# Altium schematic sheet USB_Hub_AMCbox.SchDoc: USB
size 420 x 297 mm; Author: G.Kasprowicz; CompanyName: WUT ISE; DrawnBy: G.Kasprowicz; Organization: WUT ISE; Address1: PW ISE; Address2: Nowowiejska 15/19 00-665 Warsaw; Address3: gkasprow@gmail.com; DocumentNumber: 13; Revision: 2; SheetNumber: 13; SheetTotal: 18; ModifiedBy: -; CheckedDate: -; Title2: Hub; DivGrp: WUT ISE; Designer: G.Kasprowicz; ModifiedDate: -; ProjectName: Sensor Box
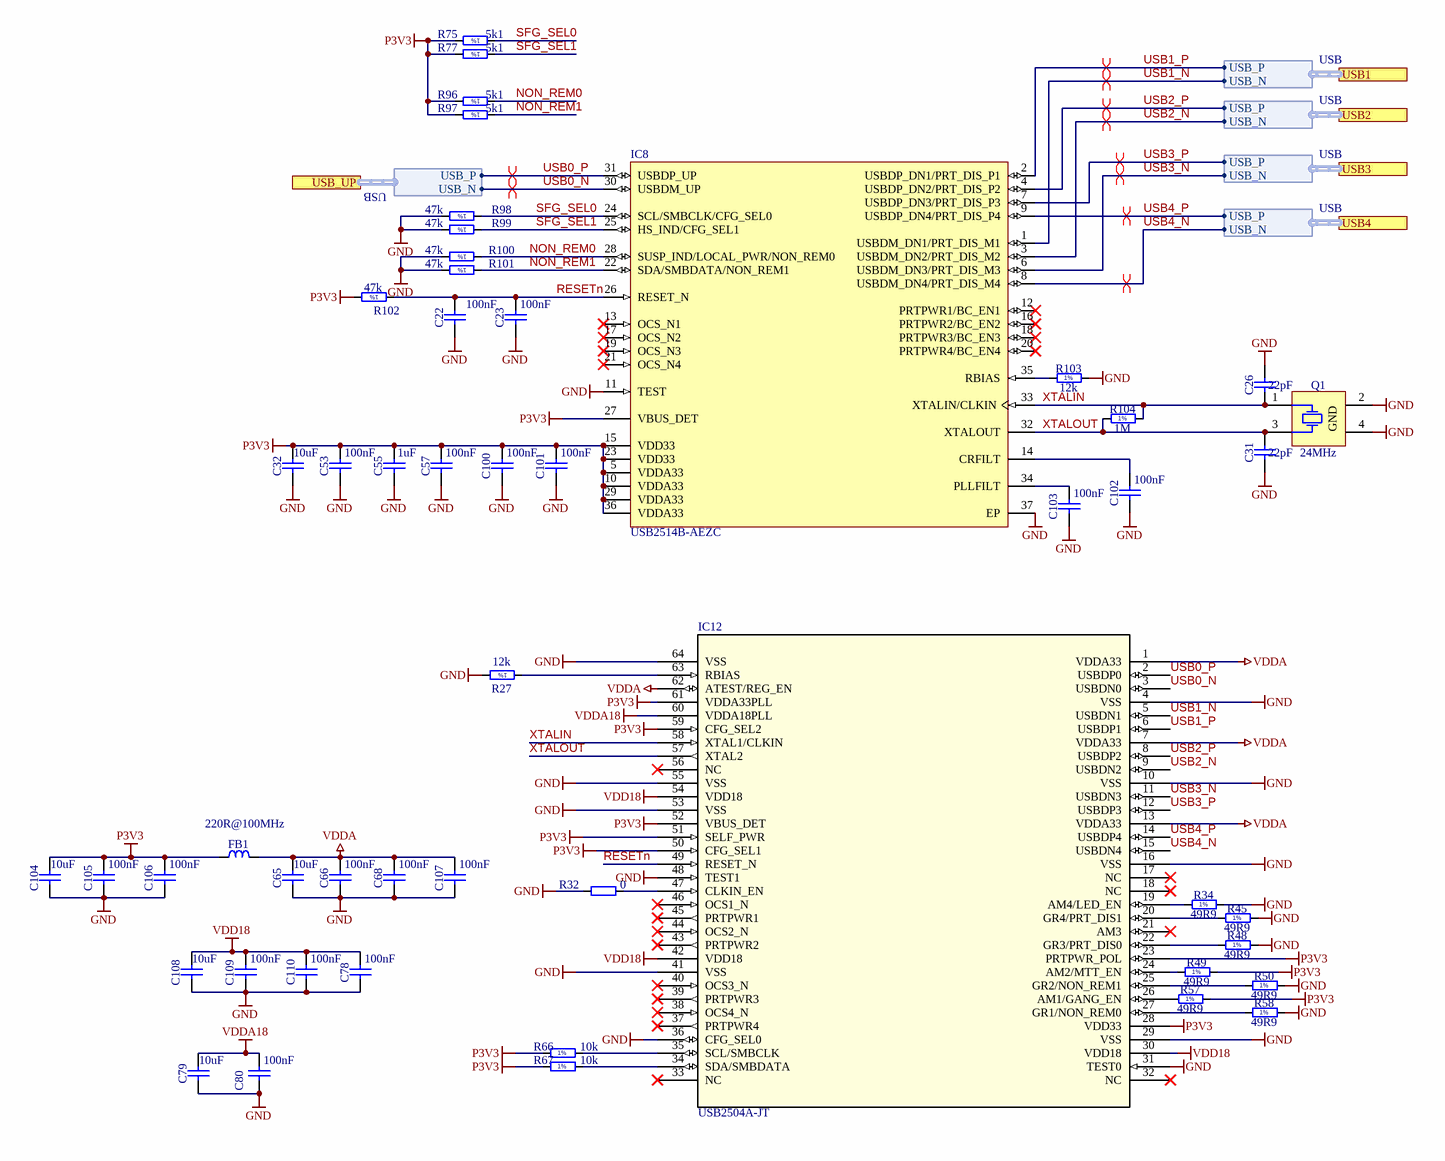
[diagram p0: USB_Hub_AMCbox.SchDoc]

## Parts
C22  100nF  [CAPC0603X33N]
C23  100nF  [CAPC0603X33N]
C26  22pF  [CAPC1005X55N]
C31  22pF  [CAPC1005X55N]
C32  10uF  [CAPC1608X80N]
C53  100nF  [CAPC0603X33N]
C55  1uF  [CAPC1005X55N]
C57  100nF  [CAPC0603X33N]
C65  10uF  [CAPC1608X80N]
C66  100nF  [CAPC0603X33N]
C68  100nF  [CAPC0603X33N]
C78  100nF  [CAPC0603X33N]
C79  10uF  [CAPC1608X80N]
C80  100nF  [CAPC0603X33N]
C100  100nF  [CAPC0603X33N]
C101  100nF  [CAPC0603X33N]
C102  100nF  [CAPC0603X33N]
C103  100nF  [CAPC0603X33N]
C104  10uF  [CAPC1608X80N]
C105  100nF  [CAPC0603X33N]
C106  100nF  [CAPC0603X33N]
C107  100nF  [CAPC0603X33N]
C108  10uF  [CAPC1608X80N]
C109  100nF  [CAPC0603X33N]
C110  100nF  [CAPC0603X33N]
FB1  220R@100MHz  [INDC2012X105N]
IC8  USB2514B-AEZC  [MCHP-QFN-36_V]
IC12  USB2504A-JT  [TQFP64_10x10MC_MCH]
Q1  24MHz  [XTAL_PERICOM_FL]
R27  12k  [RESC1005X40N]
R32  0  [RESC1005X40N]
R34  49R9  [RESC1005X40N]
R45  49R9  [RESC1005X40N]
R48  49R9  [RESC1005X40N]
R49  49R9  [RESC1005X40N]
R50  49R9  [RESC1005X40N]
R57  49R9  [RESC1005X40N]
R58  49R9  [RESC1005X40N]
R66  10k  [RESC1005X40N]
R67  10k  [RESC1005X40N]
R75  5k1  [RESC1005X40N]
R77  5k1  [RESC1005X40N]
R96  5k1  [RESC1005X40N]
R97  5k1  [RESC1005X40N]
R98  47k  [RESC1005X40N]
R99  47k  [RESC1005X40N]
R100  47k  [RESC1005X40N]
R101  47k  [RESC1005X40N]
R102  47k  [RESC1005X40N]
R103  12k  [RESC1005X40N]
R104  1M  [RESC1005X40N]

## Ports
USB1 (harness USB), USB2 (harness USB), USB3 (harness USB), USB4 (harness USB), USB_UP (harness USB)

## Harnesses
USB: USB_N, USB_P

## Nets
GND: C22.1 C23.1 C26.2 C31.1 C32.1 C53.1 C55.1 C57.1 C65.1 C66.1 C68.1 C78.1 C79.1 C80.1 C100.1 C101.1 C102.1 C103.1 C104.1 C105.1 C106.1 C107.1 C108.1 C109.1 C110.1 IC8.11(TEST) IC8.37(EP) IC12.4(VSS) IC12.10(VSS) IC12.16(VSS) IC12.29(VSS) IC12.31(TEST0) IC12.36(CFG_SEL0) IC12.41(VSS) IC12.48(TEST1) IC12.53(VSS) IC12.55(VSS) IC12.64(VSS) Q1.2(GND) Q1.4(GND) R27.2 R32.1 R34.2 R45.2 R48.2 R50.2 R58.2 R98.2 R99.2 R100.2 R101.2 R103.2
P3V3: C32.2 C53.2 C55.2 C57.2 C100.2 C101.2 C104.2 C105.2 C106.2 FB1.1 IC8.5(VDDA33) IC8.10(VDDA33) IC8.15(VDD33) IC8.23(VDD33) IC8.27(VBUS_DET) IC8.29(VDDA33) IC8.36(VDDA33) IC12.23(PRTPWR_POL) IC12.28(VDD33) IC12.50(CFG_SEL1) IC12.51(SELF_PWR) IC12.52(VBUS_DET) IC12.59(CFG_SEL2) IC12.61(VDDA33PLL) R49.2 R57.2 R66.1 R67.1 R75.2 R77.2 R96.2 R97.2 R102.2
VDD18: C78.2 C108.2 C109.2 C110.2 IC12.30(VDD18) IC12.42(VDD18) IC12.54(VDD18)
VDDA: C65.2 C66.2 C68.2 C107.2 FB1.2 IC12.1(VDDA33) IC12.7(VDDA33) IC12.13(VDDA33) IC12.62(ATEST/REG_EN)
VDDA18: C79.2 C80.2 IC12.60(VDDA18PLL)
NON_REM0: IC8.28(SUSP_IND/LOCAL_PWR/NON_REM0) R96.1 R100.1
NON_REM1: IC8.22(SDA/SMBDATA/NON_REM1) R97.1 R101.1
RESETn: C22.2 C23.2 IC8.26(RESET_N) IC12.49(RESET_N) R102.1
SFG_SEL0: IC8.24(SCL/SMBCLK/CFG_SEL0) R75.1 R98.1
SFG_SEL1: IC8.25(HS_IND/CFG_SEL1) R77.1 R99.1
USB0_N: IC8.30(USBDM_UP) IC12.3(USBDN0) ; port USB_UP.USB_N
USB0_P: IC8.31(USBDP_UP) IC12.2(USBDP0) ; port USB_UP.USB_P
USB1_N: IC8.1(USBDM_DN1/PRT_DIS_M1) IC12.5(USBDN1) ; port USB1.USB_N
USB1_P: IC8.2(USBDP_DN1/PRT_DIS_P1) IC12.6(USBDP1) ; port USB1.USB_P
USB2_N: IC8.3(USBDM_DN2/PRT_DIS_M2) IC12.9(USBDN2) ; port USB2.USB_N
USB2_P: IC8.4(USBDP_DN2/PRT_DIS_P2) IC12.8(USBDP2) ; port USB2.USB_P
USB3_N: IC8.6(USBDM_DN3/PRT_DIS_M3) IC12.11(USBDN3) ; port USB3.USB_N
USB3_P: IC8.7(USBDP_DN3/PRT_DIS_P3) IC12.12(USBDP3) ; port USB3.USB_P
USB4_N: IC8.8(USBDM_DN4/PRT_DIS_M4) IC12.15(USBDN4) ; port USB4.USB_N
USB4_P: IC8.9(USBDP_DN4/PRT_DIS_P4) IC12.14(USBDP4) ; port USB4.USB_P
XTALIN: C26.1 IC8.33(XTALIN/CLKIN) IC12.58(XTAL1/CLKIN) Q1.1(X) R104.2
XTALOUT: C31.2 IC8.32(XTALOUT) IC12.57(XTAL2) Q1.3(X) R104.1
NetC102_2: C102.2 IC8.14(CRFILT)
NetC103_2: C103.2 IC8.34(PLLFILT)
NetIC8_35: IC8.35(RBIAS) R103.1
NetIC12_19: IC12.19(AM4/LED_EN) R34.1
NetIC12_20: IC12.20(GR4/PRT_DIS1) R45.1
NetIC12_22: IC12.22(GR3/PRT_DIS0) R48.1
NetIC12_24: IC12.24(AM2/MTT_EN) R49.1
NetIC12_25: IC12.25(GR2/NON_REM1) R50.1
NetIC12_26: IC12.26(AM1/GANG_EN) R57.1
NetIC12_27: IC12.27(GR1/NON_REM0) R58.1
NetIC12_34: IC12.34(SDA/SMBDATA) R67.2
NetIC12_35: IC12.35(SCL/SMBCLK) R66.2
NetIC12_47: IC12.47(CLKIN_EN) R32.2
NetIC12_63: IC12.63(RBIAS) R27.1

Not connected (* = marked no-connect by the designer): IC8 12(PRTPWR1/BC_EN1)* 13(OCS_N1)* 16(PRTPWR2/BC_EN2)* 17(OCS_N2)* 18(PRTPWR3/BC_EN3)* 19(OCS_N3)* 20(PRTPWR4/BC_EN4)* 21(OCS_N4)*; IC12 17(NC)* 18(NC)* 21(AM3)* 32(NC)* 33(NC)* 37(PRTPWR4)* 38(OCS4_N)* 39(PRTPWR3)* 40(OCS3_N)* 43(PRTPWR2)* 44(OCS2_N)* 45(PRTPWR1)* 46(OCS1_N)* 56(NC)*

## Layout directives
differential pair: USB0_N, USB0_P, USB1_N, USB1_P, USB2_N, USB2_P, USB3_N, USB3_P, USB4_N, USB4_P

## Notes on the sheet
- Project/Equipment
- Document
- Designer
- Drawn by
- Check.by
- Copyright WUT ISE 2020.
  This documentation describes Open Hardware and is licensed under the CERN OHL v.1.2. You may redistribute and modify this documentation under the terms of the CERN OHL v.1.2. (http://ohwr.org/CERNOHL). This documentation is distributed WITHOUT ANY EXPRESS OR IMPLIED WARRANTY, INCLUDING OF MERCHANTABILITY, SATISFACTORY QUALITY AND FITNESS FOR A PARTICULAR PURPOSE. Please see the CERN OHL v.1.2 for applicable conditions.
- Contact
- File
- Last Mod.
- Print Date
- Sheet
- Size
- A3
- of
- Rev
- (in symbol R0402_1M_1%_0.0625W_100PPM) 1%
- (in symbol R0402_5K1_1%_0.0625W_100PPM) 1%
- (in symbol R0402_10K_1%_0.0625W_100PPM) 1%
- (in symbol R0402_12K_1%_0.0625W_100PPM) 1%
- (in symbol R0402_47K_1%_0.0625W_100PPM) 1%
- (in symbol R0402_49R9_1%_0.0625W_100PPM) 1%

## Library data of the parts
C22 C23 C53 C57 C66 C68 C78 C80 C100-C103 C105-C107 C109 C110 = CC0201_100NF_6.3V_10%_X5R: Non-polarised capacitor; Part Description: SMD Multilayer Chip Ceramic Capacitor; Manufacturer: GENERIC; Manufacturer1 Part Number: 02016D104KAT2A; Voltage: 6.3V; TC: X5R; Tolerance: ±10%; Part Number: CC0201_100NF_6.3V_10%_X5R; Component Kind: Standard; Component Type: Standard; Pin Count: 2; Value: 100nF; Status: Not Recommended; Manufacturer Part Number: CC0201_100NF_6.3V_10%_X5R; Case: 0201; Mounted: Yes; Socket: No; SMD: Yes; Sense: No; Manufacturer1 Example: AVX; Manufacturer1 ComponentHeight: 0.33mm; HelpURL: \\cern.ch\dfs\Applications\Altium\Datasheets\CC0201_X5R_AVX.pdf; Author: CERN DEM JLC; CreateDate: 03/12/2007; LatestRevisionDate: 03/12/2007
C26 C31 = CC0402_22PF_50V_5%_C0G: Non-polarised capacitor; Part Description: SMD Multilayer Chip Ceramic Capacitor; Manufacturer: GENERIC; Manufacturer1 Part Number: C0402C220J5GACTU; Voltage: 50V; TC: C0G/NP0; Tolerance: ±5%; Part Number: CC0402_22PF_50V_5%_C0G; Component Kind: Standard; Component Type: Standard; Pin Count: 2; Value: 22pF; Status: Preferred; Manufacturer Part Number: CC0402_22PF_50V_5%_C0G; Case: 0402; Mounted: Yes; Socket: No; SMD: Yes; Sense: No; Manufacturer1 Example: KEMET; Manufacturer1 ComponentHeight: 0.55mm; HelpURL: \\cern.ch\dfs\Applications\Altium\Datasheets\CC0402_C0G_KEMET_(Commercial Grade).pdf; Author: CERN DEM JLC; CreateDate: 03/12/2007; LatestRevisionDate: 03/12/2007
C32 C65 C79 C104 C108 = CC0603_10UF_16V_20%_X5R: Non-polarised capacitor; Part Description: SMD Multilayer Chip Ceramic Capacitor; Manufacturer: GENERIC; Manufacturer1 Part Number: GRM188R61C106MA73D; Voltage: 16V; TC: X5R; Tolerance: ±20%; Part Number: CC0603_10UF_16V_20%_X5R; Component Kind: Standard; Component Type: Standard; Pin Count: 2; Value: 10uF; Status: None; Manufacturer Part Number: CC0603_10UF_16V_20%_X5R; Case: 0603; Mounted: Yes; Socket: No; SMD: Yes; Sense: No; Manufacturer1 Example: MURATA; Manufacturer1 ComponentHeight: 0.8mm; HelpURL: \\cern.ch\dfs\Applications\Altium\Datasheets\CC0603_X5R_MURATA_GRM.pdf; Author: CERN DEM MR; CreateDate: 02/03/2016; LatestRevisionDate: 02/03/2016
C55 = CC0402_1UF_16V_10%_X5R: Non-polarised capacitor; Part Description: SMD Multilayer Chip Ceramic Capacitor; Manufacturer: GENERIC; Manufacturer1 Part Number: C1005X5R1C105KT; Voltage: 16V; TC: X5R; Tolerance: ±10%; Part Number: CC0402_1UF_16V_10%_X5R; Component Kind: Standard; Component Type: Standard; Pin Count: 2; Value: 1uF; Status: Preferred; Manufacturer Part Number: CC0402_1UF_16V_10%_X5R; Case: 0402; Mounted: Yes; Socket: No; SMD: Yes; Sense: No; Manufacturer1 Example: TDK; Manufacturer1 ComponentHeight: 0.55mm; HelpURL: \\cern.ch\dfs\Applications\Altium\Datasheets\CC0402_X5R_TDK_C.pdf; Author: CERN DEM JLC; CreateDate: 25/10/2012; LatestRevisionDate: 25/10/2012
FB1 = IND0805_MURATA_BLM21PG221SN1D: Inductor; Part Description: SMD EMIFIL Suppression Chip Ferrite Bead; Manufacturer: MURATA; Power: 2A; Resistance: 0.05R; Tolerance: ±25%; Table: Inductors SMD; Part Number: IND0805_MURATA_BLM21PG221SN1D; Component Kind: Standard; Component Type: Standard; Pin Count: 2; Value: 220R@100MHz; Status: None; Manufacturer Part Number: BLM21PG221SN1D; Case: 0805; Mounted: Yes; Socket: No; SMD: Yes; ComponentHeight: 1.05mm; HelpURL: \\cern.ch\dfs\Applications\Altium\Datasheets\IND0402_MURATA_BLM21P.pdf; Author: CERN DEM JLC; CreateDate: 2010-01-25; LatestRevisionDate: 2010-01-25
IC8 = CMP-2000-05217-1: USB 2.0 High-Speed Hub Controller, 4 Ports, 3 to 3.6 V, 0 to 85 degC, 36-Pin QFN, RoHS, Tray; Manufacturer: Microchip; Interface: I²CEEPROM,SMBus(2-Wire,I²C); Other Names: 638-1122; Voltage - Supply: 3V~3.6V; Current - Supply: 70mA; Manufacturer URL: http://www.microchip.com/; Packaging: Tray; Function: -; Standards: -; Category: IntegratedCircuits(ICs); Package / Case: 36-VFQFNExposedPad; Supplier Device Package: 36-QFN(6x6); Family: Interface-Controllers; Datasheet Version: DS00001692C, 10/2015; Standard Package: 490; Series: -; Protocol: -; Datasheet URL: http://ww1.microchip.com/downloads/en/DeviceDoc/00001692C.pdf; Operating Temperature: -
IC12 = IFC_USB2504A-JT: Integrated USB 2.0 Compatible 4-Port Hub; Manufacturer: Microchip; Copyright: Copyright (C) 2022 Ultra Librarian. All rights reserved.; Manufacturer Part Number: USB2504A-JT; RefDes: RefDes; Type: DEV
Q1 = XTAL_24MHZ_PERICOM_FL2400041: Crystal 4 pins 1=XTAL Control 2=GND3=XTAL 4=GND; Part Description: Tolerance: ±30ppm, Stability: ±30ppm, -20°C to +70°C, 18pF, SMD Seam Sealing Crystal, FL Series; PressFit: No; Bonding: No; Part Number: XTAL_24MHZ_PERICOM_FL2400041; Component Kind: Standard; Component Type: Standard; PackageDescription: 4 Pins, 2.5x3.2mm, SMD Sealing Crystal, PERICOM FL Series; Value: 24MHz; Manufacturer: PERICOM; Manufacturer Part Number: FL2400041; Pin Count: 2; Mounted: Yes; Socket: No; SMD: Yes; Sense: No; ComponentHeight: 0.75mm; HelpURL: \\cern.ch\dfs\Applications\Altium\Datasheets\XTAL_PERICOM_FL2400041.pdf; Author: CERN DEM JLC; CreateDate: 04/10/2016; LatestRevisionDate: 04/10/2016
R27 R103 = R0402_12K_1%_0.0625W_100PPM: Resistor - 1%; Part Description: General Purpose Thick Film Chip Resistor; Manufacturer: GENERIC; Manufacturer1 Part Number: 232270671203L; TC: ±100ppm/°C; PressFit: No; Part Number: R0402_12K_1%_0.0625W_100PPM; Component Kind: Standard; Component Type: Standard; Pin Count: 2; Value: 12k; Status: Not Recommended; Power: 0.0625W; Tolerance: ±1%; Manufacturer Part Number: R0402_12K_1%_0.0625W_100PPM; Case: 0402; Mounted: Yes; Sense: No; Socket: No; SMD: Yes; Manufacturer1 Example: YAGEO PHYCOMP; Manufacturer1 ComponentHeight: 0.4mm; HelpURL: \\cern.ch\dfs\Applications\Altium\Datasheets\R0402_Phycomp_RC0402.pdf; Author: CERN DEM JLC; CreateDate: 03/12/2007; LatestRevisionDate: 17/10/2012
R32 = R0402_0R_JUMPER: Resistor; Part Description: 1A (0.05R Max DC Resistance) Zero Ohm Jumper; Manufacturer: GENERIC; Manufacturer1 Part Number: 232270591001L; PressFit: No; Part Number: R0402_0R_JUMPER; Component Kind: Standard; Component Type: Standard; Pin Count: 2; Value: 0; Status: Not Recommended; Manufacturer Part Number: R0402_0R_JUMPER; Case: 0402; Mounted: Yes; Socket: No; SMD: Yes; Manufacturer1 Example: YAGEO PHYCOMP; Manufacturer1 ComponentHeight: 0.4mm; HelpURL: \\cern.ch\dfs\Applications\Altium\Datasheets\R0402_Phycomp_RC0402.pdf; Author: CERN DEM JLC; CreateDate: 03.12.2007; LatestRevisionDate: 17.10.2012; Sense: No
R34 R45 R48-R50 R57 R58 = R0402_49R9_1%_0.0625W_100PPM: Resistor - 1%; Part Description: General Purpose Thick Film Chip Resistor; Manufacturer: GENERIC; Manufacturer1 Part Number: 232270674999L or RC0402FR-0749R9L; TC: ±100ppm/°C; Table: Resistors SMD; Part Number: R0402_49R9_1%_0.0625W_100PPM; Component Kind: Standard; Component Type: Standard; Pin Count: 2; Value: 49R9; Status: Not recommended; Power: 0.0625W; Tolerance: ±1%; Manufacturer Part Number: R0402_49R9_1%_0.0625W_100PPM; Case: 0402; Mounted: Yes; Socket: No; SMD: Yes; Manufacturer1 Example: YAGEO PHYCOMP; Manufacturer1 ComponentHeight: 0.4mm; HelpURL: \\cern.ch\dfs\Applications\Altium\Datasheets\R0402_Phycomp_RC0402.pdf; Author: CERN DEM JLC; CreateDate: 2012-10-24; LatestRevisionDate: 2012-10-24
R66 R67 = R0402_10K_1%_0.0625W_100PPM: Resistor - 1%; Part Description: General Purpose Thick Film Chip Resistor; Manufacturer: GENERIC; Manufacturer1 Part Number: 232270671003L; TC: ±100ppm/°C; Table: Resistors SMD; Part Number: R0402_10K_1%_0.0625W_100PPM; Component Kind: Standard; Component Type: Standard; Pin Count: 2; Value: 10k; Status: Not recommended; Power: 0.0625W; Tolerance: ±1%; Manufacturer Part Number: R0402_10K_1%_0.0625W_100PPM; Case: 0402; Mounted: Yes; Socket: No; SMD: Yes; Manufacturer1 Example: YAGEO PHYCOMP; Manufacturer1 ComponentHeight: 0.4mm; HelpURL: \\cern.ch\dfs\Applications\Altium\Datasheets\R0402_Phycomp_RC0402.pdf; Author: CERN DEM JLC; CreateDate: 2007-12-03; LatestRevisionDate: 2012-10-17
R75 R77 R96 R97 = R0402_5K1_1%_0.0625W_100PPM: Resistor - 1%; Part Description: General Purpose Thick Film Chip Resistor; Manufacturer: GENERIC; Manufacturer1 Part Number: 232270675102L; TC: ±100ppm/°C; PressFit: No; Part Number: R0402_5K1_1%_0.0625W_100PPM; Component Kind: Standard; Component Type: Standard; Pin Count: 2; Value: 5k1; Status: Not Recommended; Power: 0.0625W; Tolerance: ±1%; Manufacturer Part Number: R0402_5K1_1%_0.0625W_100PPM; Case: 0402; Mounted: Yes; Sense: No; Socket: No; SMD: Yes; Manufacturer1 Example: YAGEO PHYCOMP; Manufacturer1 ComponentHeight: 0.4mm; HelpURL: \\cern.ch\dfs\Applications\Altium\Datasheets\R0402_Phycomp_RC0402.pdf; Author: CERN DEM JLC; CreateDate: 03/12/2007; LatestRevisionDate: 17/10/2012
R98-R102 = R0402_47K_1%_0.0625W_100PPM: Resistor - 1%; Manufacturer: GENERIC; Part Description: General Purpose Thick Film Chip Resistor; Manufacturer1 Part Number: 232270675103L; TC: ±100ppm/°C; PressFit: No; Manufacturer Part Number: R0402_47K_1%_0.0625W_100PPM; Part Number: R0402_47K_1%_0.0625W_100PPM; Tolerance: ±1%; Value: 47k; Component Kind: Standard; Component Type: Standard; Pin Count: 2; Status: Not Recommended; Power: 0.0625W; Case: 0402; Mounted: Yes; Sense: No; Socket: No; SMD: Yes; Manufacturer1 Example: YAGEO PHYCOMP; Manufacturer1 ComponentHeight: 0.4mm; HelpURL: \\cern.ch\dfs\Applications\Altium\Datasheets\R0402_Phycomp_RC0402.pdf; Author: CERN DEM JLC; CreateDate: 03.12.2007; LatestRevisionDate: 17.10.2012
R104 = R0402_1M_1%_0.0625W_100PPM: Resistor - 1%; Part Description: General Purpose Thick Film Chip Resistor; Manufacturer: GENERIC; Manufacturer1 Part Number: 232270671005L; TC: ±100ppm/°C; PressFit: No; Part Number: R0402_1M_1%_0.0625W_100PPM; Component Kind: Standard; Component Type: Standard; Pin Count: 2; Value: 1M; Status: Not Recommended; Power: 0.0625W; Tolerance: ±1%; Manufacturer Part Number: R0402_1M_1%_0.0625W_100PPM; Case: 0402; Mounted: Yes; Sense: No; Socket: No; SMD: Yes; Manufacturer1 Example: YAGEO PHYCOMP; Manufacturer1 ComponentHeight: 0.4mm; HelpURL: \\cern.ch\dfs\Applications\Altium\Datasheets\R0402_Phycomp_RC0402.pdf; Author: CERN DEM JLC; CreateDate: 03/12/2007; LatestRevisionDate: 17/10/2012